# EAGLE design eCog104_Joystick_PSP_Slide (EAGLE 6.6.0)
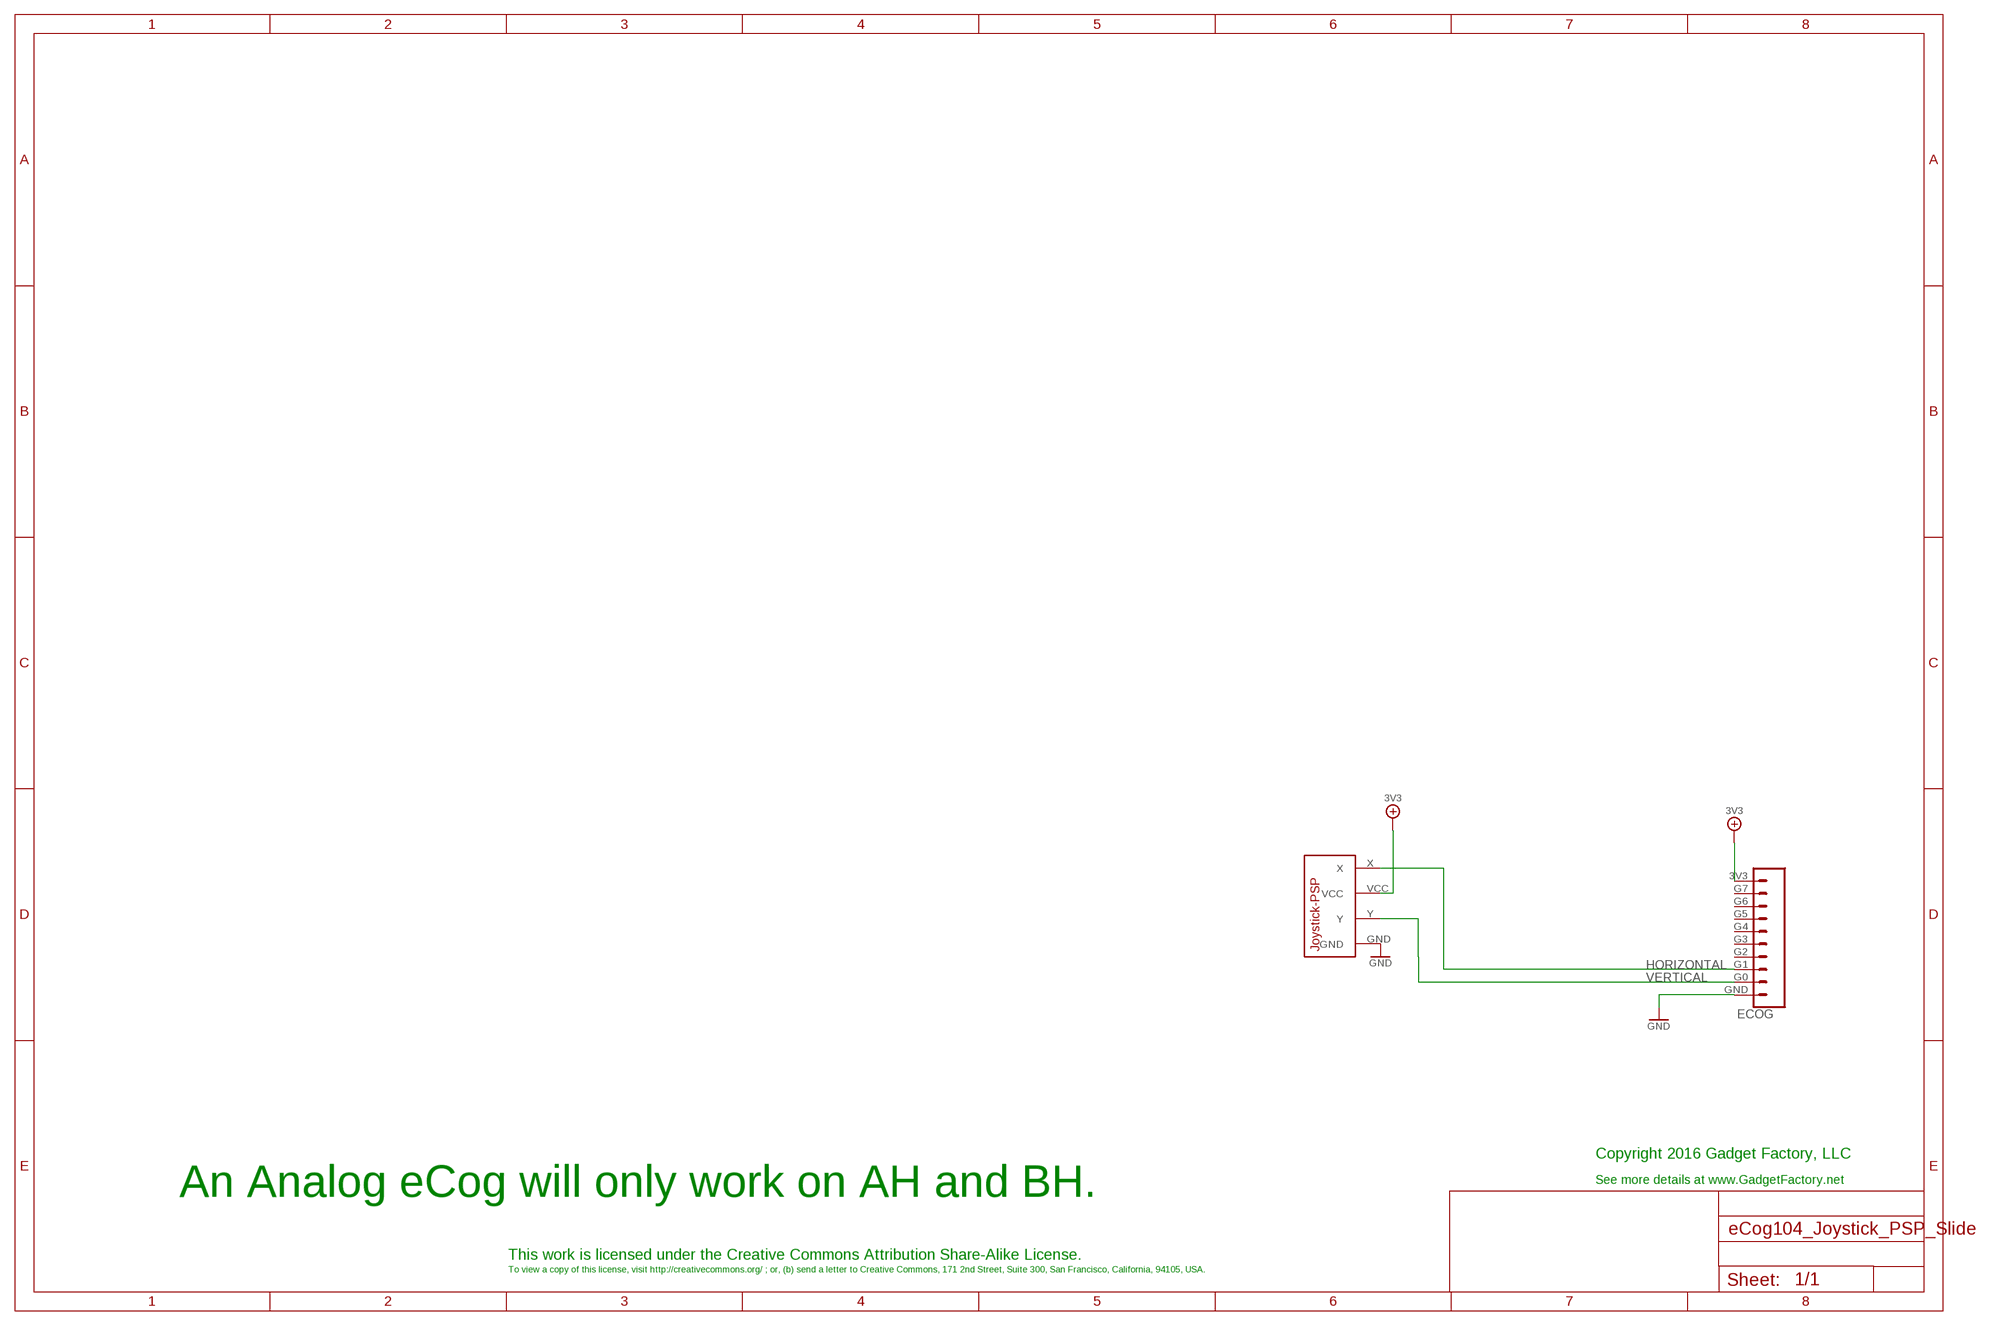
[diagram p0: schematic, sheet 1]

## Parts
ECOG  ECOG_GENERAL_ROWECOG_GENERAL_SMD  [ECOG_GENERAL_SMD]
U$4  JOYSTICK-PSP1000  [JOYSTICK-PSP1000]

## Nets
3V3: ECOG.3V3 U$4.VCC
GND: ECOG.GND U$4.GND
HORIZONTAL: ECOG.G1 U$4.X
VERTICAL: ECOG.G0 U$4.Y
Unconnected: ECOG.G2 ECOG.G3 ECOG.G4 ECOG.G5 ECOG.G6 ECOG.G7

## Notes on the sheet
- Copyright 2016 Gadget Factory, LLC
- See more details at www.GadgetFactory.net
- An Analog eCog will only work on AH and BH.
- This work is licensed under the Creative Commons Attribution Share-Alike License.
- To view a copy of this license, visit http://creativecommons.org/ ; or, (b) send a letter to Creative Commons, 171 2nd Street, Suite 300, San Francisco, California, 94105, USA.

## Library data of the parts
ECOG = eCogs:ECOG_GENERAL_ROW; DIGIKEY: S1013EC-10-ND
U$4 = SparkFun:JOYSTICK-PSP1000: This is a footprint for the PSP-1000 Joystick. 4-pins: X, Y, Vcc and GND; SPARKFUN: COM-09426

## Board
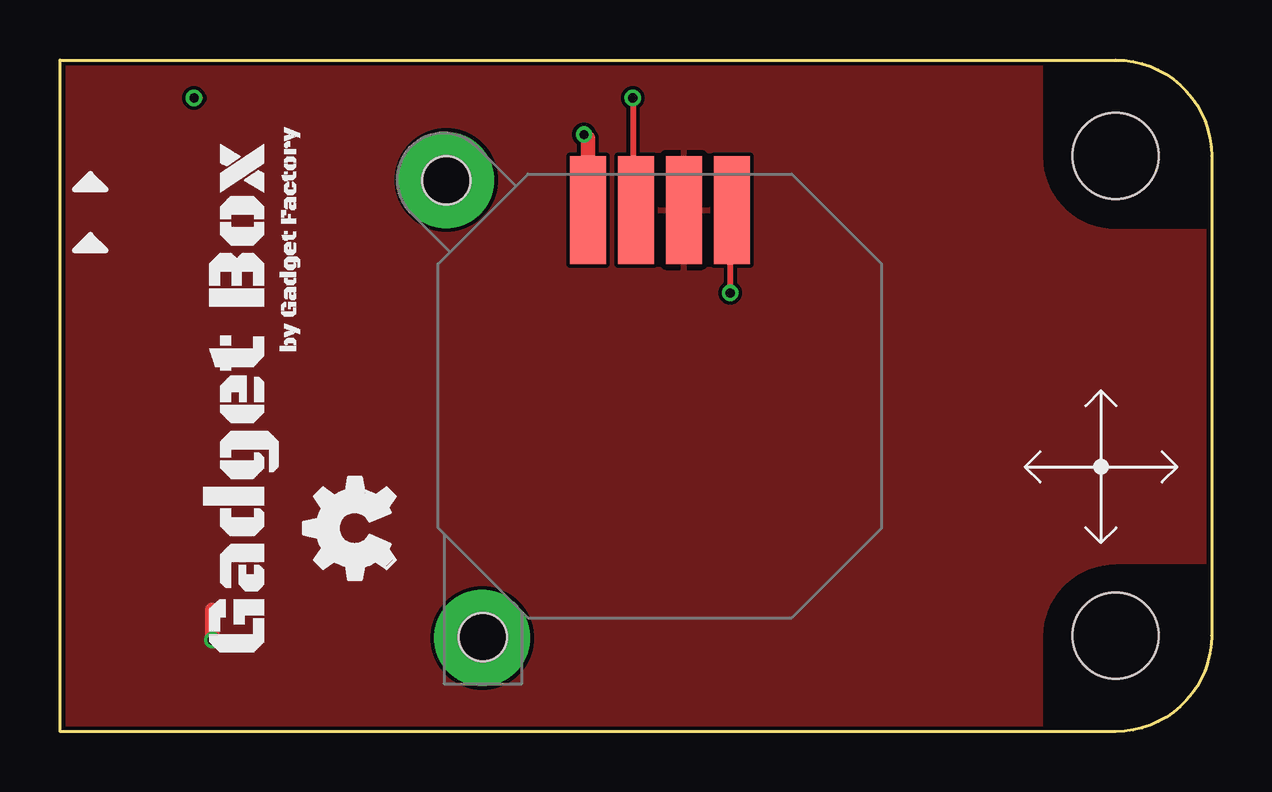
[diagram p1: board, top side]
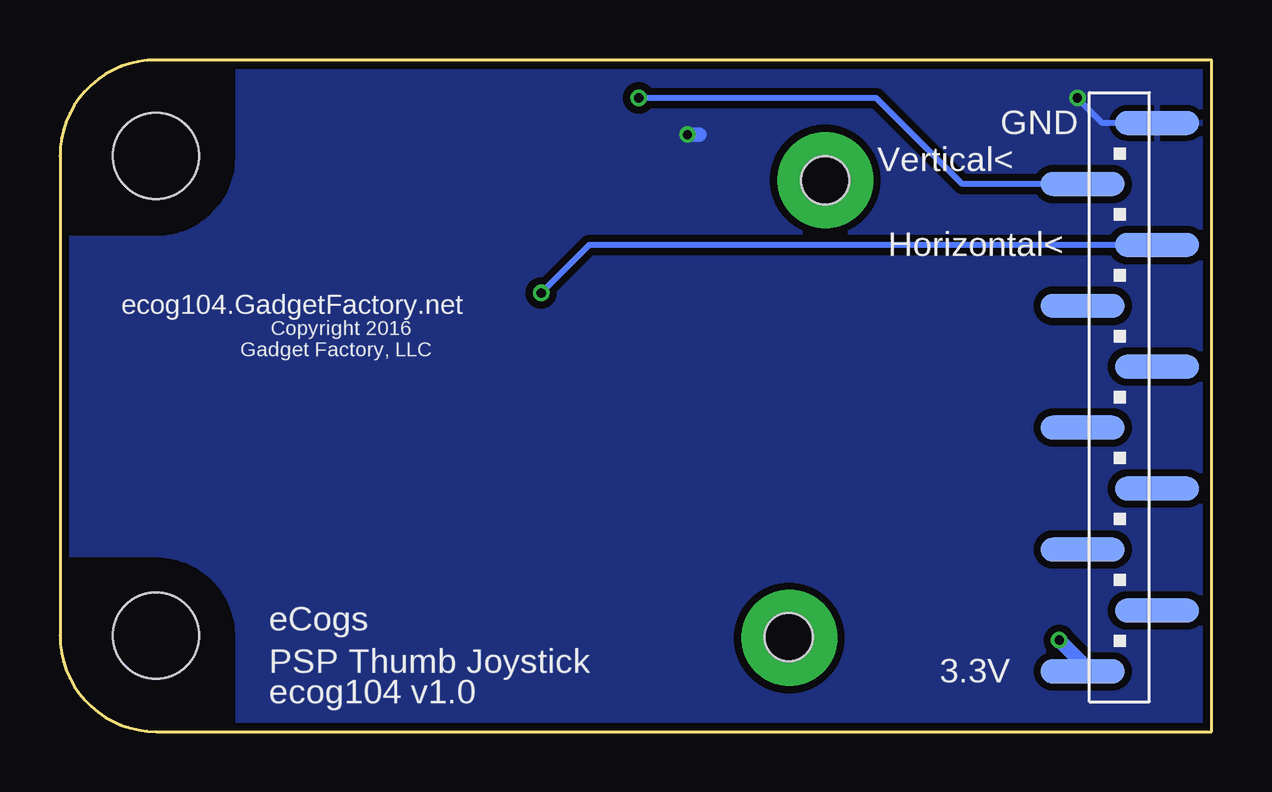
[diagram p2: board, bottom side, seen from below]

Size 48 x 28 mm. Coordinates in mm from the lower left corner, seen from the top.
Copper layers (1*16): Top 0.035mm / dielectric 1.5mm / Bottom 0.035mm
Design rules "hackvana *": minimum track width 6mil, minimum drill 0.3mm, track to track 6mil, track to pad 6mil, pad to pad 6mil, via to via 6mil, smd to smd 0mil, copper to edge 6mil, drill to drill 6mil, minimum pad ring 10mil, minimum via ring 6mil, stop-mask expansion 2mil, vias tented up to drill 100mil, thermal gap 10mil

### Footprints (pad centres in the part's own frame; a part is rotated, then mirrored left to right if it is on the bottom)
ECOG_GENERAL_SMD = smd 3.5 x 1 bottom: 3V3 5.369,2.51; G0 5.369,22.83; G1 2.271,20.29; G2 5.369,17.75; G3 2.271,15.21; G4 5.369,12.67; G5 2.271,10.13; G6 5.369,7.59; G7 2.271,5.05; GND 2.271,25.37 | hole 3.6: 44,4; 44,24
JOYSTICK-PSP1000 = smd 1.5 x 4.5: GND -3,7.75; VCC 1,7.75; X 3,7.75; Y -1,7.75 | hole 2: -8.89,8.985; -7.375,-10.06

### Placement (x,y rotation side)
ECOG  0,0 0 top
U$1  [LEGEND_ANALOG]  1.27,20.32 0 top
U$2  [LEGEND_ANALOG]  1.27,22.86 0 top
U$3  [GADGETBOX_SMALL]  7.62,13.97 90 top
U$4  25,14 0 top
U$5  [OSHW_FILLX150_NOTEXT]  13.97,6.35 90 top

### Tracks (layer width: path | path; a pad name or v marks a point on that pad's centre or on a via)
3V3  (via drill 0.38)
  Top 0.61: v6.35,3.81 6.35,5.08
  Bottom 0.61: ECOG.3V3 5.37,2.83 v6.35,3.81
  pour Top: -1.27,29.27 49.27,29.27 49.27,-1.27 -1.27,-1.27
GND  (via drill 0.38)
  Top 0.254: v5.59,26.42 5.84,26.42
  Top 0.61: U$4.GND 22,24.74 v21.84,24.89
  Bottom 0.254: ECOG.GND 4.54,25.37 v5.59,26.42
  Bottom 0.61: v21.84,24.89 21.34,24.89
  pour Bottom (isolate 0.305): -2.54,30.54 50.54,30.54 50.54,-2.54 -2.54,-2.54
HORIZONTAL  (via drill 0.38)
  Top 0.254: v27.94,18.29 27.94,21.69 U$4.X
  Bottom 0.254: ECOG.G1 25.94,20.29 v27.94,18.29
N$1  (via drill 2 pad 4)
  other vias: 16.1,23
N$2  (via drill 2 pad 4)
  other vias: 17.6,3.9
VERTICAL  (via drill 0.38)
  Top 0.254: v23.88,26.42 23.88,21.87 U$4.Y
  Bottom 0.254: ECOG.G0 10.38,22.83 13.97,26.42 v23.88,26.42

### Text on the board
bPlace: GND | Vertical< | Horizontal< | Copyright 2016 | ecog104.GadgetFactory.net | Gadget Factory, LLC | eCogs | 3.3V | PSP Thumb Joystick | ecog104 v1.0